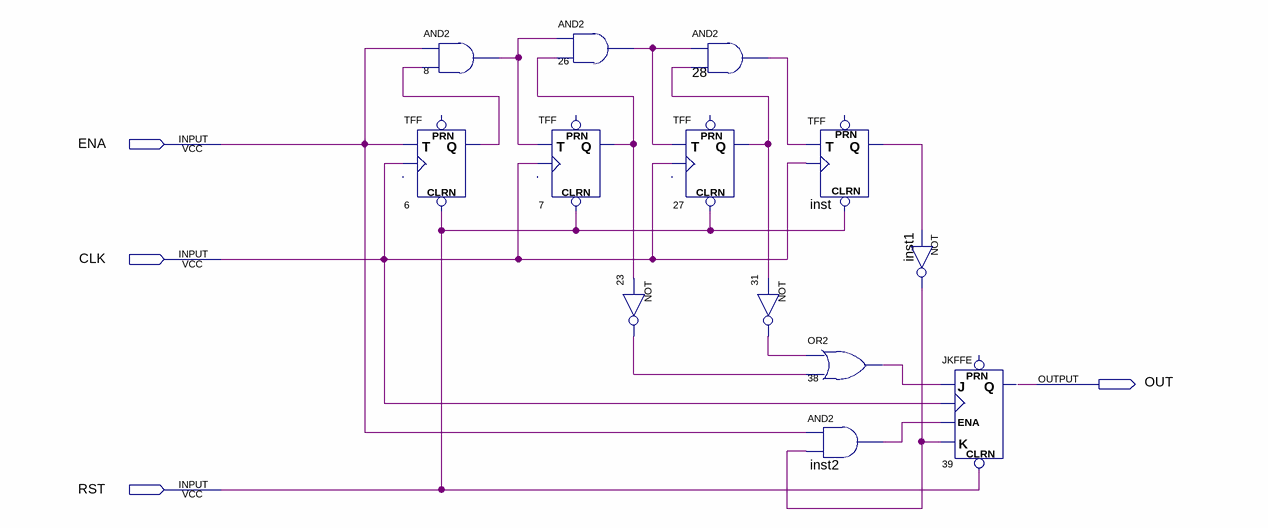
[diagram p0: schematic sheet]
// Quartus schematic blinker.bdf as structural Verilog: 13 symbols, 4 pins
module blinker (
  input  ENA,
  input  CLK,
  input  RST,
  output OUT
);

  wire inst1_out, inst2_out, inst_q, n6_q, n7_q, n8_out, n23_out, n26_out, n27_q, n28_out, n31_out, n38_out;

  and u_8 (n8_out, ENA, n6_q);
  TFF u_6 (.CLRN(RST), .T(ENA), .CLK(CLK), .Q(n6_q));  // open: PRN
  TFF u_7 (.CLRN(RST), .T(n8_out), .CLK(CLK), .Q(n7_q));  // open: PRN
  and u_26 (n26_out, n8_out, n7_q);
  not u_23 (n23_out, n7_q);
  and u_28 (n28_out, n26_out, n27_q);
  TFF u_27 (.CLRN(RST), .T(n26_out), .CLK(CLK), .Q(n27_q));  // open: PRN
  not u_31 (n31_out, n27_q);
  TFF inst (.CLRN(RST), .T(n28_out), .CLK(CLK), .Q(inst_q));  // open: PRN
  or u_38 (n38_out, n31_out, n23_out);
  and inst2 (inst2_out, ENA, inst1_out);
  not inst1 (inst1_out, inst_q);
  JKFFE u_39 (.J(n38_out), .CLK(CLK), .CLRN(RST), .K(inst1_out), .ENA(inst2_out), .Q(OUT));  // open: PRN
endmodule
